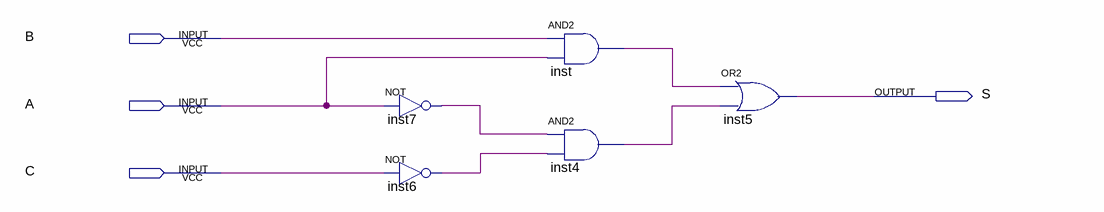
[diagram p0: schematic sheet]
// Quartus schematic circuitoFigura2.bdf as structural Verilog: 5 symbols, 4 pins
module circuitoFigura2 (
  input  B,
  input  A,
  input  C,
  output S
);

  wire inst4_out, inst6_out, inst7_out, inst_out;

  not inst7 (inst7_out, A);
  not inst6 (inst6_out, C);
  and inst (inst_out, B, A);
  and inst4 (inst4_out, inst7_out, inst6_out);
  or inst5 (S, inst_out, inst4_out);
endmodule
